# Altium schematic sheet Power.SchDoc: SPEC-A7
size 420 x 297 mm; Author: G.Kasprowicz; CompanyName: WUT ISE; DrawnBy: G.Kasprowicz; Organization: WUT ISE; Address1: PW ISE; Address2: Nowowiejska 15/19 00-665 Warsaw; Address3: gkasprow@gmail.com; Revision: 2; SheetNumber: 2; SheetTotal: 18; ModifiedBy: -; CheckedDate: -; Title2: Power supply; DivGrp: WUT ISE; Designer: G.Kasprowicz; ModifiedDate: -; ProjectName: Sensor Box
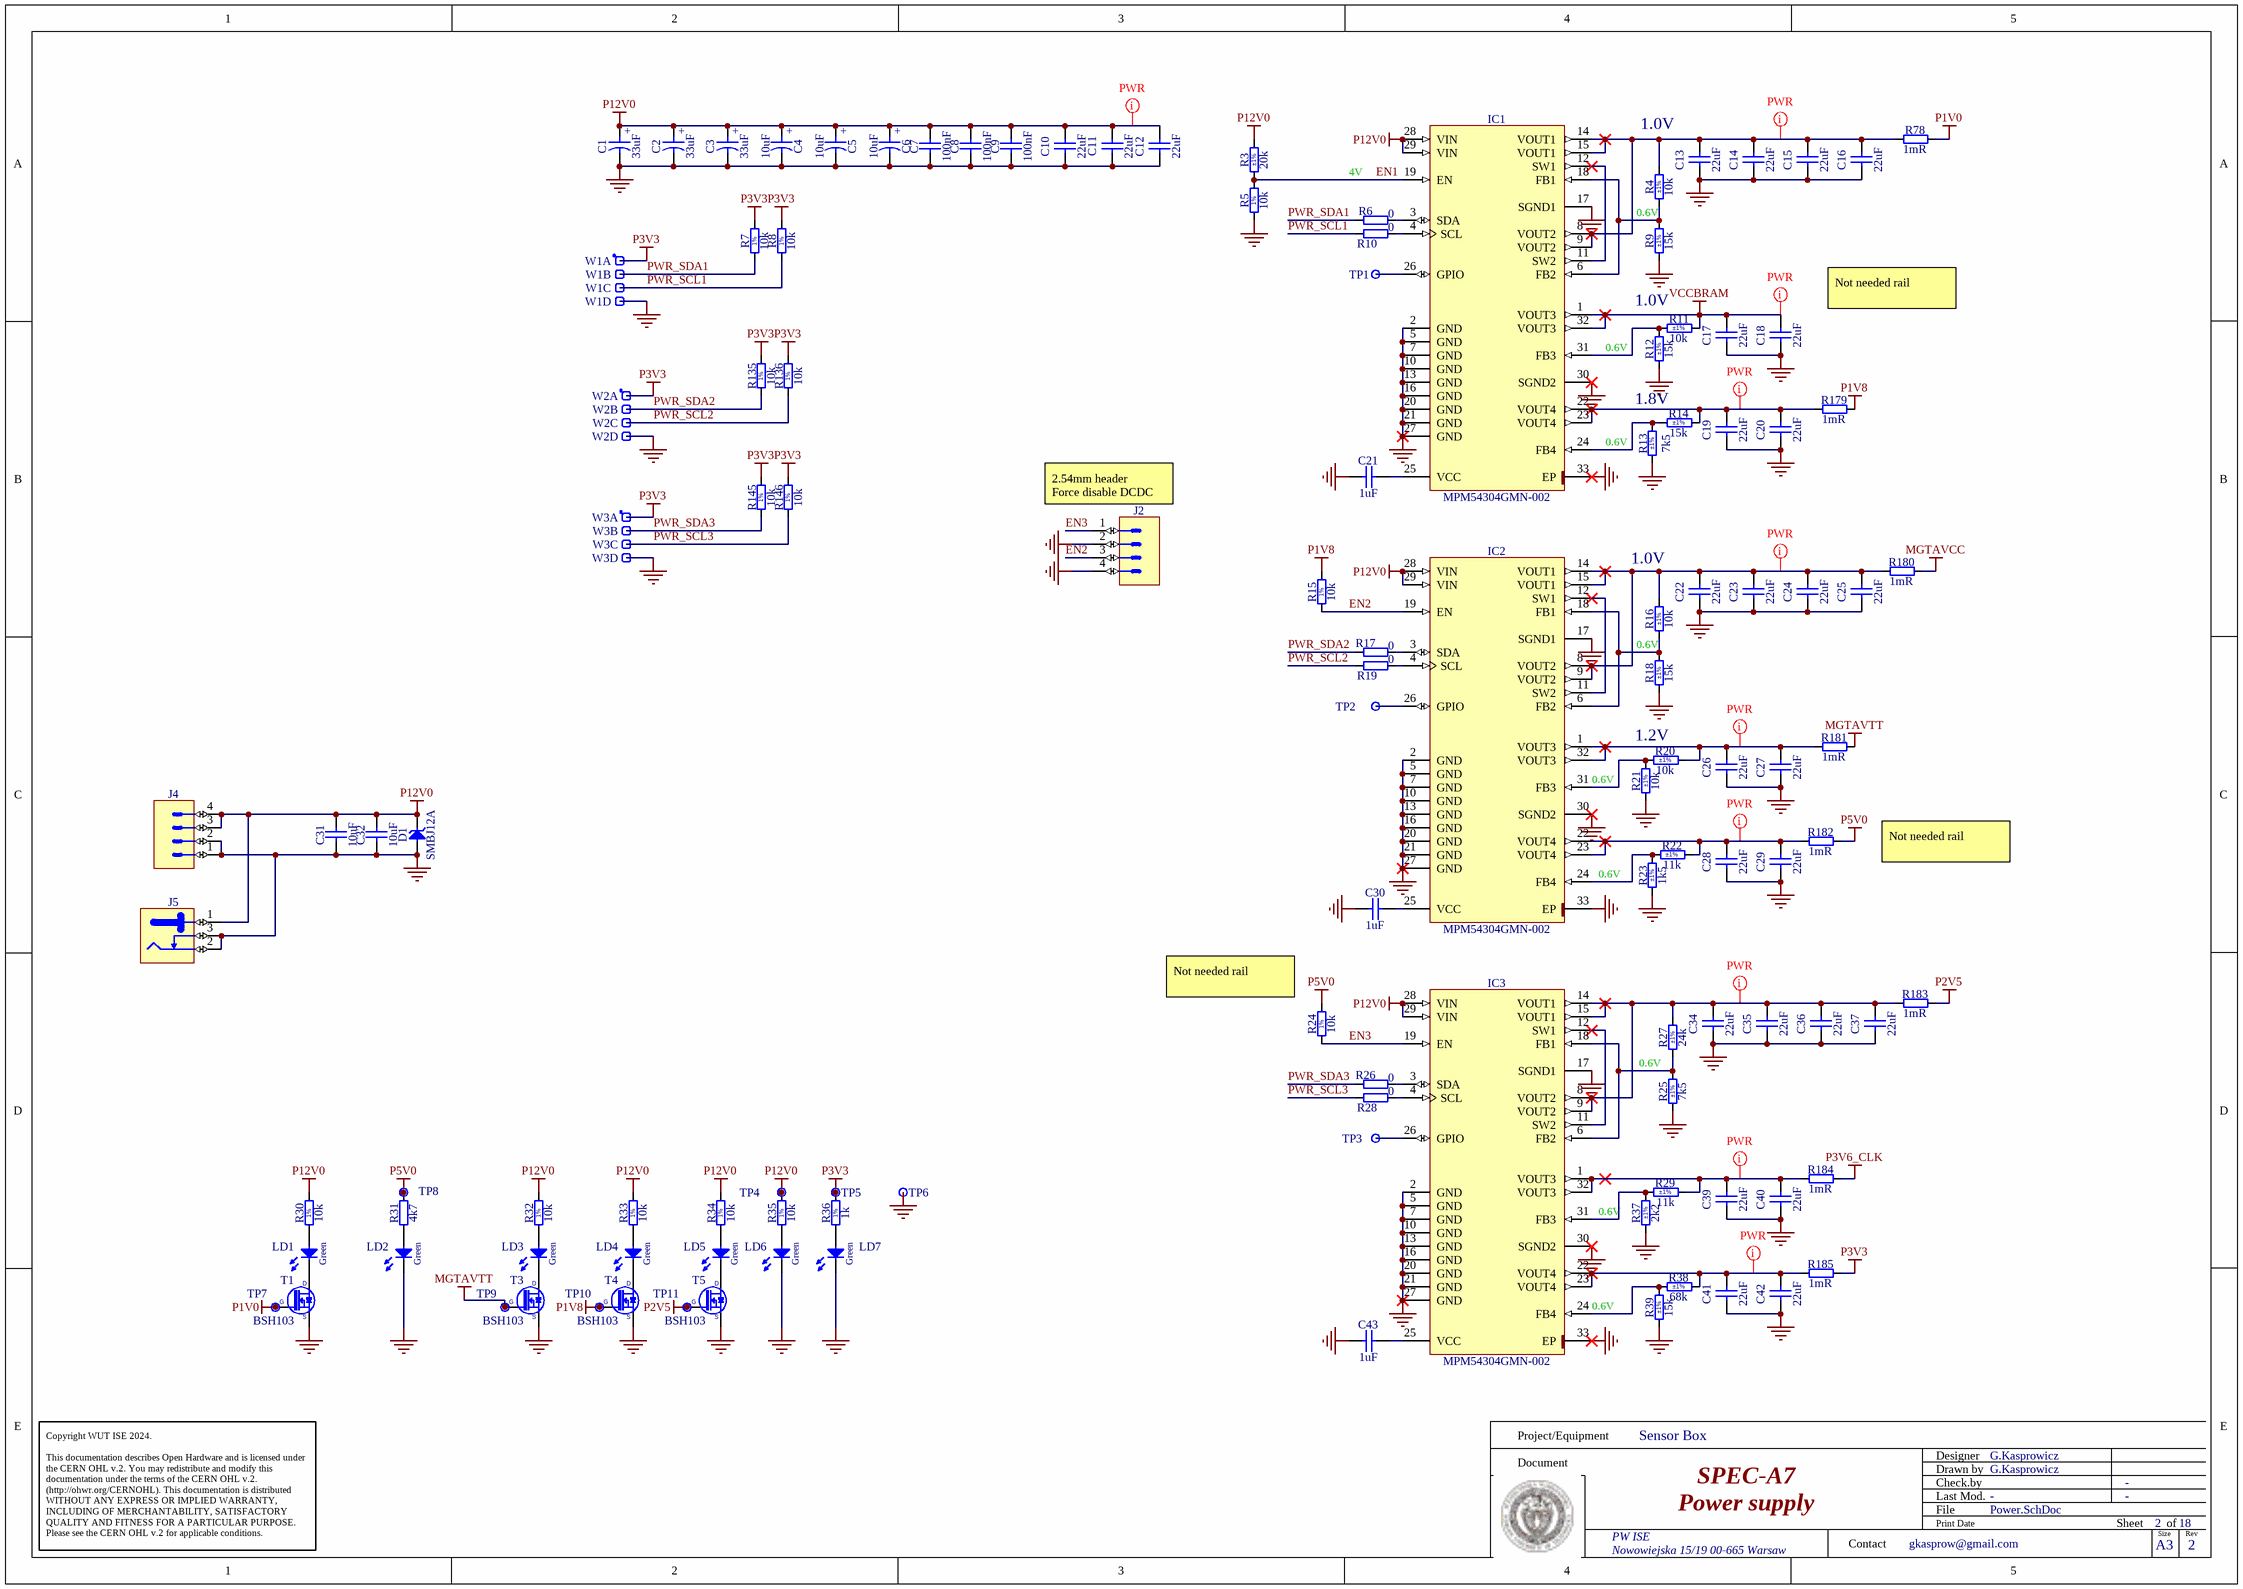
[diagram p0: Power.SchDoc]

## Parts
C1  33uF  [CAPMP3528X210N]
C2  33uF  [CAPMP3528X210N]
C3  33uF  [CAPMP3528X210N]
C4  10uF  [CAPMP3216X180N]
C5  10uF  [CAPMP3216X180N]
C6  10uF  [CAPMP3216X180N]
C7  100nF  [CAPC1005X55N]
C8  100nF  [CAPC1005X55N]
C9  100nF  [CAPC1005X55N]
C10  22uF  [CAPC2012X135N]
C11  22uF  [CAPC2012X135N]
C12  22uF  [CAPC2012X135N]
C13  22uF  [CAPC2012X135N]
C14  22uF  [CAPC2012X135N]
C15  22uF  [CAPC2012X135N]
C16  22uF  [CAPC2012X135N]
C17  22uF  [CAPC2012X135N]
C18  22uF  [CAPC2012X135N]
C19  22uF  [CAPC2012X135N]
C20  22uF  [CAPC2012X135N]
C21  1uF  [CAPC1005X55N]
C22  22uF  [CAPC2012X135N]
C23  22uF  [CAPC2012X135N]
C24  22uF  [CAPC2012X135N]
C25  22uF  [CAPC2012X135N]
C26  22uF  [CAPC2012X135N]
C27  22uF  [CAPC2012X135N]
C28  22uF  [CAPC2012X135N]
C29  22uF  [CAPC2012X135N]
C30  1uF  [CAPC1005X55N]
C31  10uF  [CAPC1608X80N]
C32  10uF  [CAPC1608X80N]
C34  22uF  [CAPC2012X135N]
C35  22uF  [CAPC2012X135N]
C36  22uF  [CAPC2012X135N]
C37  22uF  [CAPC2012X135N]
C39  22uF  [CAPC2012X135N]
C40  22uF  [CAPC2012X135N]
C41  22uF  [CAPC2012X135N]
C42  22uF  [CAPC2012X135N]
C43  1uF  [CAPC1005X55N]
D1  SMBJ12A  [DIOM5336X265N]
IC1  MPM54304GMN-002  [MPS_MPM54304GMN]
IC2  MPM54304GMN-002  [MPS_MPM54304GMN]
IC3  MPM54304GMN-002  [MPS_MPM54304GMN]
J2  Header 2  [SAMTEC_TSM-102-01-L-DV]  (value not drawn)
J4  Mini-Fit Jr.™  [MOLEX_39-30-0040]  (value not drawn)
J5  Jack  [CUI_PJ-102BH]  (value not drawn)
LD1  Green  [LED_KINGBRIGHT_KPH-1608CGCK]
LD2  Green  [LED_KINGBRIGHT_KPH-1608CGCK]
LD3  Green  [LED_KINGBRIGHT_KPH-1608CGCK]
LD4  Green  [LED_KINGBRIGHT_KPH-1608CGCK]
LD5  Green  [LED_KINGBRIGHT_KPH-1608CGCK]
LD6  Green  [LED_KINGBRIGHT_KPH-1608CGCK]
LD7  Green  [LED_KINGBRIGHT_KPH-1608CGCK]
R3  20k  Tolerance: ±1%  [RESC1005X40N]
R4  10k  Tolerance: ±1%  [RESC1005X40N]
R5  10k  [RESC1005X40N]
R6  0  [RESC1005X40N]
R7  10k  [RESC1005X40N]
R8  10k  [RESC1005X40N]
R9  15k  Tolerance: ±1%  [RESC1005X40N]
R10  0  [RESC1005X40N]
R11  10k  Tolerance: ±1%  [RESC1005X40N]
R12  15k  Tolerance: ±1%  [RESC1005X40N]
R13  7k5  Tolerance: ±1%  [RESC1005X40N]
R14  15k  Tolerance: ±1%  [RESC1005X40N]
R15  10k  [RESC1005X40N]
R16  10k  Tolerance: ±1%  [RESC1005X40N]
R17  0  [RESC1005X40N]
R18  15k  Tolerance: ±1%  [RESC1005X40N]
R19  0  [RESC1005X40N]
R20  10k  Tolerance: ±1%  [RESC1005X40N]
R21  10k  Tolerance: ±1%  [RESC1005X40N]
R22  11k  Tolerance: ±1%  [RESC1005X40N]
R23  1k5  Tolerance: ±1%  [RESC1005X40N]
R24  10k  [RESC1005X40N]
R25  7k5  Tolerance: ±1%  [RESC1005X40N]
R26  0  [RESC1005X40N]
R27  24k  Tolerance: ±1%  [RESC1005X40N]
R28  0  [RESC1005X40N]
R29  11k  Tolerance: ±1%  [RESC1005X40N]
R30  10k  [RESC1005X40N]
R31  4k7  [RESC1005X40N]
R32  10k  [RESC1005X40N]
R33  10k  [RESC1005X40N]
R34  10k  [RESC1005X40N]
R35  10k  [RESC1005X40N]
R36  1k  [RESC1005X40N]
R37  2k2  Tolerance: ±1%  [RESC1005X40N]
R38  68k  Tolerance: ±1%  [RESC1005X40N]
R39  15k  Tolerance: ±1%  [RESC1005X40N]
R78  1mR  [RESC2012X60N]
R135  10k  [RESC1005X40N]
R136  10k  [RESC1005X40N]
R145  10k  [RESC1005X40N]
R146  10k  [RESC1005X40N]
R179  1mR  [RESC2012X60N]
R180  1mR  [RESC2012X60N]
R181  1mR  [RESC2012X60N]
R182  1mR  [RESC2012X60N]
R183  1mR  [RESC2012X60N]
R184  1mR  [RESC2012X60N]
R185  1mR  [RESC2012X60N]
T1  BSH103  [SOT95P230X110-3N]
T3  BSH103  [SOT95P230X110-3N]
T4  BSH103  [SOT95P230X110-3N]
T5  BSH103  [SOT95P230X110-3N]
TP1  Test Point  [TPS127]  (value not drawn)  (no BOM)
TP2  Test Point  [TPS127]  (value not drawn)  (no BOM)
TP3  Test Point  [TPS127]  (value not drawn)  (no BOM)
TP4  Test Point  [TPS127]  (value not drawn)  (no BOM)
TP5  Test Point  [TPS127]  (value not drawn)  (no BOM)
TP6  Test Point  [TPS127]  (value not drawn)  (no BOM)
TP7  Test Point  [TPS127]  (value not drawn)  (no BOM)
TP8  Test Point  [TPS127]  (value not drawn)  (no BOM)
TP9  Test Point  [TPS127]  (value not drawn)  (no BOM)
TP10  Test Point  [TPS127]  (value not drawn)  (no BOM)
TP11  Test Point  [TPS127]  (value not drawn)  (no BOM)
W1  Header 4  [SAMTEC_HTSW-104-23-L-S]  (value not drawn)  (parts A,B,C,D of 4)
W2  Header 4  [SAMTEC_HTSW-104-23-L-S]  (value not drawn)  (parts A,B,C,D of 4)
W3  Header 4  [SAMTEC_HTSW-104-23-L-S]  (value not drawn)  (parts A,B,C,D of 4)

## Nets
GND: C1.2 C2.2 C3.2 C4.2 C5.2 C6.2 C7.1 C8.1 C9.1 C10.1 C11.1 C12.1 C13.1 C14.1 C15.1 C16.1 C17.1 C18.1 C19.1 C20.1 C21.1 C22.1 C23.1 C24.1 C25.1 C26.1 C27.1 C28.1 C29.1 C30.1 C31.1 C32.1 C34.1 C35.1 C36.1 C37.1 C39.1 C40.1 C41.1 C42.1 C43.1 D1.2(A) IC1.2(GND) IC1.5(GND) IC1.7(GND) IC1.10(GND) IC1.13(GND) IC1.16(GND) IC1.17(SGND1) IC1.20(GND) IC1.21(GND) IC1.27(GND) IC1.30(SGND2) IC1.33(EP) IC2.2(GND) IC2.5(GND) IC2.7(GND) IC2.10(GND) IC2.13(GND) IC2.16(GND) IC2.17(SGND1) IC2.20(GND) IC2.21(GND) IC2.27(GND) IC2.30(SGND2) IC2.33(EP) IC3.2(GND) IC3.5(GND) IC3.7(GND) IC3.10(GND) IC3.13(GND) IC3.16(GND) IC3.17(SGND1) IC3.20(GND) IC3.21(GND) IC3.27(GND) IC3.30(SGND2) IC3.33(EP) J2.2 J2.4 J4.1 J4.2 J5.2 J5.3 LD2.1(C) LD6.1(C) LD7.1(C) R5.1 R9.1 R12.1 R13.1 R18.1 R21.1 R23.1 R25.1 R37.1 R39.1 T1.2(S) T3.2(S) T4.2(S) T5.2(S) TP6.1 W1.4 W2.4 W3.4
MGTAVCC: R180.2
MGTAVTT: R181.2 T3.1(G) TP9.1
P1V0: R78.2 T1.1(G) TP7.1
P1V8: R15.2 R179.2 T4.1(G) TP10.1
P2V5: R183.2 T5.1(G) TP11.1
P3V3: R7.2 R8.2 R36.2 R135.2 R136.2 R145.2 R146.2 R185.2 TP5.1 W1.1 W2.1 W3.1
P3V6_CLK: R184.2
P5V0: R24.2 R31.2 R182.2 TP8.1
P12V0: C1.1 C2.1 C3.1 C4.1 C5.1 C6.1 C7.2 C8.2 C9.2 C10.2 C11.2 C12.2 C31.2 C32.2 D1.1(C) IC1.28(VIN) IC1.29(VIN) IC2.28(VIN) IC2.29(VIN) IC3.28(VIN) IC3.29(VIN) J4.3 J4.4 J5.1 R3.2 R30.2 R32.2 R33.2 R34.2 R35.2 TP4.1
VCCBRAM: C17.2 C18.2 IC1.1(VOUT3) IC1.32(VOUT3) R11.2
EN1: IC1.19(EN) R3.1 R5.2
EN2: IC2.19(EN) J2.3 R15.1
EN3: IC3.19(EN) J2.1 R24.1
PWR_SCL1: R8.1 R10.1 W1.3
PWR_SCL2: R19.1 R136.1 W2.3
PWR_SCL3: R28.1 R146.1 W3.3
PWR_SDA1: R6.1 R7.1 W1.2
PWR_SDA2: R17.1 R135.1 W2.2
PWR_SDA3: R26.1 R145.1 W3.2
NetC13_2: C13.2 C14.2 C15.2 C16.2 IC1.8(VOUT2) IC1.9(VOUT2) IC1.14(VOUT1) IC1.15(VOUT1) R4.2 R78.1
NetC19_2: C19.2 C20.2 IC1.22(VOUT4) IC1.23(VOUT4) R14.2 R179.1
NetC21_2: C21.2 IC1.25(VCC)
NetC22_2: C22.2 C23.2 C24.2 C25.2 IC2.8(VOUT2) IC2.9(VOUT2) IC2.14(VOUT1) IC2.15(VOUT1) R16.2 R180.1
NetC26_2: C26.2 C27.2 IC2.1(VOUT3) IC2.32(VOUT3) R20.2 R181.1
NetC28_2: C28.2 C29.2 IC2.22(VOUT4) IC2.23(VOUT4) R22.2 R182.1
NetC30_2: C30.2 IC2.25(VCC)
NetC34_2: C34.2 C35.2 C36.2 C37.2 IC3.8(VOUT2) IC3.9(VOUT2) IC3.14(VOUT1) IC3.15(VOUT1) R27.2 R183.1
NetC39_2: C39.2 C40.2 IC3.1(VOUT3) IC3.32(VOUT3) R29.2 R184.1
NetC41_2: C41.2 C42.2 IC3.22(VOUT4) IC3.23(VOUT4) R38.2 R185.1
NetC43_2: C43.2 IC3.25(VCC)
NetIC1_3: IC1.3(SDA) R6.2
NetIC1_4: IC1.4(SCL) R10.2
NetIC1_6: IC1.6(FB2) IC1.18(FB1) R4.1 R9.2
NetIC1_11: IC1.11(SW2) IC1.12(SW1)
NetIC1_24: IC1.24(FB4) R13.2 R14.1
NetIC1_26: IC1.26(GPIO) TP1.1
NetIC1_31: IC1.31(FB3) R11.1 R12.2
NetIC2_3: IC2.3(SDA) R17.2
NetIC2_4: IC2.4(SCL) R19.2
NetIC2_6: IC2.6(FB2) IC2.18(FB1) R16.1 R18.2
NetIC2_11: IC2.11(SW2) IC2.12(SW1)
NetIC2_24: IC2.24(FB4) R22.1 R23.2
NetIC2_26: IC2.26(GPIO) TP2.1
NetIC2_31: IC2.31(FB3) R20.1 R21.2
NetIC3_3: IC3.3(SDA) R26.2
NetIC3_4: IC3.4(SCL) R28.2
NetIC3_6: IC3.6(FB2) IC3.18(FB1) R25.2 R27.1
NetIC3_11: IC3.11(SW2) IC3.12(SW1)
NetIC3_24: IC3.24(FB4) R38.1 R39.2
NetIC3_26: IC3.26(GPIO) TP3.1
NetIC3_31: IC3.31(FB3) R29.1 R37.2
NetLD1_1: LD1.1(C) T1.3(D)
NetLD1_2: LD1.2(A) R30.1
NetLD2_2: LD2.2(A) R31.1
NetLD3_1: LD3.1(C) T3.3(D)
NetLD3_2: LD3.2(A) R32.1
NetLD4_1: LD4.1(C) T4.3(D)
NetLD4_2: LD4.2(A) R33.1
NetLD5_1: LD5.1(C) T5.3(D)
NetLD5_2: LD5.2(A) R34.1
NetLD6_2: LD6.2(A) R35.1
NetLD7_2: LD7.2(A) R36.1

## Layout directives
net class PWR: NetC13_2, NetC19_2, NetC22_2, NetC26_2, NetC28_2, NetC34_2, NetC39_2, NetC41_2, P12V0, VCCBRAM

## Notes on the sheet
- 4V
- 1.0V
- 0.6V
- (near C18) Not needed rail
- 1.8V
- (near J2) 2.54mm header
  Force disable DCDC
- 1.2V
- (near R182) Not needed rail
- (near R24) Not needed rail
- (near IC3) 0.6V
- Project/Equipment
- Document
- Designer
- Drawn by
- Check.by
- Copyright WUT ISE 2024.
  This documentation describes Open Hardware and is licensed under the CERN OHL v.2. You may redistribute and modify this documentation under the terms of the CERN OHL v.2. (http://ohwr.org/CERNOHL). This documentation is distributed WITHOUT ANY EXPRESS OR IMPLIED WARRANTY, INCLUDING OF MERCHANTABILITY, SATISFACTORY QUALITY AND FITNESS FOR A PARTICULAR PURPOSE. Please see the CERN OHL v.2 for applicable conditions.
- Contact
- File
- Last Mod.
- Print Date
- Sheet
- Size
- A3
- of
- Rev
- (in symbol CTE3216-18_10UF_16V_20%_AVX_TCJ) +
- (in symbol CTE3528-21_33UF_16V_10%) +
- (in symbol R0402_1k_1%_0.0625W_100PPM) 1%
- (in symbol R0402_10k_1%_0.0625W_100PPM) 1%
- (in symbol R0402_10K_1%_0.0625W_100PPM) 1%

## Library data of the parts
C1-C3 = CTE3528-21_33UF_16V_10%: Polarised capacitor; Part Description: Solid Tantalum Chip Capacitor; Manufacturer: GENERIC; Manufacturer1 Part Number: TAJB336K016R; Voltage: 16V; Tolerance: ±10%; Part Number: CTE3528-21_33UF_16V_10%; Component Kind: Standard; Component Type: Standard; Pin Count: 2; Value: 33uF; Status: Preferred; Manufacturer Part Number: CTE3528-21_33UF_16V_10%; Case: B; Mounted: Yes; Socket: No; SMD: Yes; Sense: No; HelpURL: \\cern.ch\dfs\Applications\Altium\Datasheets\CTE_AVX_TAJ.pdf; Author: CERN DEM JLC; CreateDate: 03.12.2007; LatestRevisionDate: 03.12.2007; Manufacturer1 Example: AVX; Manufacturer1 ComponentHeight: 2.1mm
C4-C6 = CTE3216-18_10UF_16V_20%_AVX_TCJ: Polarised capacitor; Part Description: ESR 0R200 Tantalum Solid Electrolytic Chip Capacitor with Conductive Polymer Electrode; Manufacturer: AVX; Manufacturer Part Number: TCJA106M016R0200; Voltage: 16V; Tolerance: ±20%; Part Number: CTE3216-18_10UF_16V_20%_AVX_TCJ; Component Kind: Standard; Component Type: Standard; Pin Count: 2; Value: 10uF; Status: Preferred; Case: A; Mounted: Yes; Socket: No; SMD: Yes; Sense: No; ComponentHeight: 1.8mm; HelpURL: \\cern.ch\dfs\Applications\Altium\Datasheets\CTE_AVX_TCJ.pdf; Author: CERN DEM JLC; CreateDate: 29.03.2012; LatestRevisionDate: 29.03.2012
C7-C9 = CC0402_100NF_16V_10%_X7R: Non-polarised capacitor; Part Description: SMD Multilayer Chip Ceramic Capacitor; Manufacturer: GENERIC; Manufacturer1 Part Number: GRM155R71C104KA88D; Voltage: 16V; TC: X7R; Tolerance: ±10%; Part Number: CC0402_100NF_16V_10%_X7R; Component Kind: Standard; Component Type: Standard; Pin Count: 2; Value: 100nF; Status: Not Recommended; Manufacturer Part Number: CC0402_100NF_16V_10%_X7R; Case: 0402; Mounted: Yes; Socket: No; SMD: Yes; Sense: No; Manufacturer1 Example: MURATA; Manufacturer1 ComponentHeight: 0.55mm; HelpURL: \\cern.ch\dfs\Applications\Altium\Datasheets\CC0402_X7R_MURATA_GRM.pdf; Author: CERN DEM JLC; CreateDate: 05/12/2013; LatestRevisionDate: 03/12/2007
C10-C20 C22-C29 C34-C37 C39-C42 = CC0805_22UF_16V_10%_X5R: Non-polarised capacitor; Manufacturer: GENERIC; Part Description: SMD Multilayer Chip Ceramic Capacitor; Manufacturer1 Part Number: C2012X5R1C226KT; Tolerance: ±10%; Voltage: 16V; TC: X5R; Manufacturer Part Number: CC0805_22UF_16V_10%_X5R; Part Number: CC0805_22UF_16V_10%_X5R; Value: 22uF; Component Kind: Standard; Component Type: Standard; Pin Count: 2; Status: Preferred; Case: 0805; Mounted: Yes; Socket: No; SMD: Yes; Sense: No; Manufacturer1 Example: TDK; Manufacturer1 ComponentHeight: 1.35mm; HelpURL: \\cern.ch\dfs\Applications\Altium\Datasheets\CC0805_X5R_TDK_C.pdf; Author: CERN DEM JLC; CreateDate: 25.10.2012; LatestRevisionDate: 25.10.2012
C21 C30 C43 = CC0402_1UF_16V_10%_X5R: Non-polarised capacitor; Part Description: SMD Multilayer Chip Ceramic Capacitor; Manufacturer: GENERIC; Manufacturer1 Part Number: C1005X5R1C105KT; Voltage: 16V; TC: X5R; Tolerance: ±10%; Part Number: CC0402_1UF_16V_10%_X5R; Component Kind: Standard; Component Type: Standard; Pin Count: 2; Value: 1uF; Status: Preferred; Manufacturer Part Number: CC0402_1UF_16V_10%_X5R; Case: 0402; Mounted: Yes; Socket: No; SMD: Yes; Sense: No; Manufacturer1 Example: TDK; Manufacturer1 ComponentHeight: 0.55mm; HelpURL: \\cern.ch\dfs\Applications\Altium\Datasheets\CC0402_X5R_TDK_C.pdf; Author: CERN DEM JLC; CreateDate: 25.10.2012; LatestRevisionDate: 25.10.2012
C31 C32 = CC0603_10UF_16V_20%_X5R: Non-polarised capacitor; Part Description: SMD Multilayer Chip Ceramic Capacitor; Manufacturer: GENERIC; Manufacturer1 Part Number: GRM188R61C106MA73D; Voltage: 16V; TC: X5R; Tolerance: ±20%; Part Number: CC0603_10UF_16V_20%_X5R; Component Kind: Standard; Component Type: Standard; Pin Count: 2; Value: 10uF; Status: None; Manufacturer Part Number: CC0603_10UF_16V_20%_X5R; Case: 0603; Mounted: Yes; Socket: No; SMD: Yes; Sense: No; Manufacturer1 Example: MURATA; Manufacturer1 ComponentHeight: 0.8mm; HelpURL: \\cern.ch\dfs\Applications\Altium\Datasheets\CC0603_X5R_MURATA_GRM.pdf; Author: CERN DEM MR; CreateDate: 02.03.2016; LatestRevisionDate: 02.03.2016
D1 = SMBJ12A: Zener Diode; Part Description: Uni-Directional Transient Voltage Suppressor Diode; Manufacturer: FAIRCHILD SEMICONDUCTOR; Voltage: 12V; Power: 600W; PressFit: No; Bonding: No; Part Number: SMBJ12A; Component Kind: Standard; Component Type: Standard; Device: SMBJ12A; PackageDescription: DO-214-AA/SMB Diode, Molded Body; 5.34mm L X 3.625mm W X 2.65mm H, IPC Medium Density; Manufacturer Part Number: SMBJ12A; Pin Count: 2; Case: DO-214AA; Mounted: Yes; Socket: No; SMD: Yes; Sense: No; ComponentHeight: 2.65mm; HelpURL: \\cern.ch\dfs\Applications\Altium\Datasheets\SMBJ.pdf; Author: CERN DEM JLC; CreateDate: 10.04.2013; LatestRevisionDate: 10.04.2013
IC1-IC3 = MPM54304GMN-XXXX: Quad-Output Power Module with I2C and MTP; Part Description: 4V to 16V Input, Quad-Output Power Module with I2C and MTP; Manufacturer: MPS (MONOLITIC  POWER SYSTEMS); PressFit: No; Bonding: No; Part Number: MPM54304GMN-002; Component Kind: Standard; Component Type: Standard; Device: MPM54304GMN-002; PackageDescription: MPS LGA-33 Case, 0.65mm Pitch, Rect.; 32 Pin, 7.00mm L X 7.00mm W X 2.10mm H body (w/Thermal Tab 3.55 X 3.55mm); Manufacturer Part Number: MPM54304GMN-002; Pin Count: 33; Case: QFN32; Mounted: Yes; Socket: No; SMD: Yes; Sense: No; ComponentHeight: 2.1mm; HelpURL: \\cern.ch\dfs\Applications\Altium\Datasheets\MPM54304GMN.pdf; Author: CERN DEM BC; CreateDate: 09.11.2020; LatestRevisionDate: 23.11.2022
J2 = SAMTEC_TSM-102-01-L-DV: Connector 4 Male; Part Description: 2 Contacts, Pitch 2.54mm, Dual Row Surface Mount Straight Header (Post Lead 5.84mm); Manufacturer: SAMTEC; PressFit: No; Part Number: SAMTEC_TSM-102-01-L-DV; Component Kind: Standard; Component Type: Standard; Pin Count: 4; Family: Header 2; Mounted: Yes; Socket: No; SMD: Yes; Sense: No; Status: None; Manufacturer Part Number: TSM-102-01-L-DV; ComponentHeight: 9.65mm; HelpURL: \\cern.ch\dfs\Applications\Altium\Datasheets\SAMTEC_TSM-102-01-L-DV.pdf; Author: CERN DEM MR; CreateDate: 28.11.2017; LatestRevisionDate: 28.11.2017
J4 = MOLEX_39-30-0040: Connector 4 Male; Part Description: 4.20mm (.165") Pitch Mini-Fit Jr. Header, Dual Row, Right Angle with Snap-in Plastic Peg PCB Lock, 4 Circuits; Manufacturer: MOLEX; PressFit: No; Part Number: MOLEX_39-30-0040; Component Kind: Standard; Component Type: Standard; Pin Count: 4; Family: Mini-Fit Jr.™; Mounted: Yes; Socket: No; SMD: No; Sense: No; Status: None; Manufacturer Part Number: 39-30-0040; ComponentHeight: 11.4mm; HelpURL: \\cern.ch\dfs\Applications\Altium\Datasheets\MOLEX_39-30-0040.pdf; Author: CERN DEM JLC; CreateDate: 2018-10-02; LatestRevisionDate: 2018-10-02
J5 = CUI_PJ-102BH: 2.5 mm Center Pin, 5A, 24V Right Angle, Through Hole, Tapered Pins, DC Power Jack Connector; Part Description: 2.5 mm Center Pin, 5A, 24V, Right Angle, Through Hole, Tapered Pins, DC Power Jack Connector; Manufacturer: CUI INC.; PressFit: No; Part Number: CUI_PJ-102BH; Component Kind: Standard; Component Type: Standard; Pin Count: 3; Family: Jack; Mounted: Yes; Socket: No; SMD: No; Sense: No; Status: None; Manufacturer Part Number: PJ-102BH; ComponentHeight: 11mm; HelpURL: \\cern.ch\dfs\Applications\Altium\Datasheets\CUI_PJ-102BH.pdf; Author: CERN DEM JLC; CreateDate: 14.08.2013; LatestRevisionDate: 14.08.2013
LD1-LD7 = LED_KINGBRIGHT_KPH-1608CGCK: LED Green 1C 2A; Part Description: SMD Green LED, Case 1.6mmX0.8mm(0603), 0.65mm Thickness; PressFit: No; Bonding: No; Manufacturer Part Number: KPH-1608CGCK; ComponentHeight: 0.65mm; HelpURL: \\cern.ch\dfs\Applications\Altium\Datasheets\LED_KINGBRIGHT_KPH-1608CGCK.pdf; Part Number: LED_KINGBRIGHT_KPH-1608CGCK; Component Kind: Standard; Component Type: Standard; Color: Green; PackageDescription: SMT Green LED, Case 0603, Body L 1.6 x W 0.8mm H 0.65mm; Manufacturer: KINGBRIGHT; Pin Count: 2; Mounted: Yes; Socket: No; SMD: Yes; Sense: No; Author: CERN DEM JLC; CreateDate: 03.07.2017; LatestRevisionDate: 03.07.2017
R3 = R0402_20K_1%_0.0625W_100PPM: Resistor - 1%; Part Description: General Purpose Thick Film Chip Resistor; Manufacturer: GENERIC; Manufacturer1 Part Number: 232270672003L; TC: ±100ppm/°C; PressFit: No; Part Number: R0402_20K_1%_0.0625W_100PPM; Component Kind: Standard; Component Type: Standard; Pin Count: 2; Value: 20k; Status: Not Recommended; Power: 0.0625W; Manufacturer Part Number: R0402_20K_1%_0.0625W_100PPM; Case: 0402; Mounted: Yes; Sense: No; Socket: No; SMD: Yes; Manufacturer1 Example: YAGEO PHYCOMP; Manufacturer1 ComponentHeight: 0.4mm; HelpURL: \\cern.ch\dfs\Applications\Altium\Datasheets\R0402_Phycomp_RC0402.pdf; Author: CERN DEM JLC; CreateDate: 03.12.2007; LatestRevisionDate: 17.10.2012
R4 R5 R7 R8 R11 R15 R16 R20 R21 R24 R135 R136 R145 R146 = R0402_10K_1%_0.0625W_100PPM: Resistor - 1%; Part Description: General Purpose Thick Film Chip Resistor; Manufacturer: GENERIC; Manufacturer1 Part Number: 232270671003L; TC: ±100ppm/°C; PressFit: No; Part Number: R0402_10K_1%_0.0625W_100PPM; Component Kind: Standard; Component Type: Standard; Pin Count: 2; Value: 10k; Status: Not Recommended; Power: 0.0625W; Manufacturer Part Number: R0402_10K_1%_0.0625W_100PPM; Case: 0402; Mounted: Yes; Sense: No; Socket: No; SMD: Yes; Manufacturer1 Example: YAGEO PHYCOMP; Manufacturer1 ComponentHeight: 0.4mm; HelpURL: \\cern.ch\dfs\Applications\Altium\Datasheets\R0402_Phycomp_RC0402.pdf; Author: CERN DEM JLC; CreateDate: 03.12.2007; LatestRevisionDate: 17.10.2012
  R5 R7 R8 R15 R24 R135 R136 R145 R146: Tolerance: ±1%
R6 R10 R17 R19 R26 R28 = R0402_0R_JUMPER: Resistor; Part Description: 1A (0.05R Max DC Resistance) Zero Ohm Jumper; Manufacturer: GENERIC; Manufacturer1 Part Number: 232270591001L; PressFit: No; Part Number: R0402_0R_JUMPER; Component Kind: Standard; Component Type: Standard; Pin Count: 2; Value: 0; Status: Not Recommended; Manufacturer Part Number: R0402_0R_JUMPER; Case: 0402; Mounted: Yes; Sense: No; Socket: No; SMD: Yes; Manufacturer1 Example: YAGEO PHYCOMP; Manufacturer1 ComponentHeight: 0.4mm; HelpURL: \\cern.ch\dfs\Applications\Altium\Datasheets\R0402_Phycomp_RC0402.pdf; Author: CERN DEM JLC; CreateDate: 03.12.2007; LatestRevisionDate: 17.10.2012
R9 R12 R14 R18 R39 = R0402_15K_1%_0.0625W_100PPM: Resistor - 1%; Part Description: General Purpose Thick Film Chip Resistor; Manufacturer: GENERIC; Manufacturer1 Part Number: CRCW040215K0FK; TC: ±100ppm/°C; PressFit: No; Part Number: R0402_15K_1%_0.0625W_100PPM; Component Kind: Standard; Component Type: Standard; Pin Count: 2; Value: 15k; Status: Preferred; Power: 0.0625W; Manufacturer Part Number: R0402_15K_1%_0.0625W_100PPM; Case: 0402; Mounted: Yes; Sense: No; Socket: No; SMD: Yes; Manufacturer1 Example: VISHAY; Manufacturer1 ComponentHeight: 0.4mm; HelpURL: \\cern.ch\dfs\Applications\Altium\Datasheets\R0402_VISHAY_CRCW e3.pdf; Author: CERN DEM JMW; CreateDate: 06.07.2015; LatestRevisionDate: 06.07.2015
R13 R25 = R0402_7K5_1%_0.0625W_100PPM: Resistor - 1%; Part Description: General Purpose Thick Film Chip Resistor; Manufacturer: GENERIC; Manufacturer1 Part Number: 232270677502L; TC: ±100ppm/°C; PressFit: No; Part Number: R0402_7K5_1%_0.0625W_100PPM; Component Kind: Standard; Component Type: Standard; Pin Count: 2; Value: 7k5; Status: Not Recommended; Power: 0.0625W; Manufacturer Part Number: R0402_7K5_1%_0.0625W_100PPM; Case: 0402; Mounted: Yes; Sense: No; Socket: No; SMD: Yes; Manufacturer1 Example: YAGEO PHYCOMP; Manufacturer1 ComponentHeight: 0.4mm; HelpURL: \\cern.ch\dfs\Applications\Altium\Datasheets\R0402_Phycomp_RC0402.pdf; Author: CERN DEM JLC; CreateDate: 03.12.2007; LatestRevisionDate: 17.10.2012
R22 R29 = R0402_11K_1%_0.0625W_100PPM: Resistor - 1%; Part Description: General Purpose Thick Film Chip Resistor; Manufacturer: GENERIC; Manufacturer1 Part Number: 232270671103L; TC: ±100ppm/°C; PressFit: No; Part Number: R0402_11K_1%_0.0625W_100PPM; Component Kind: Standard; Component Type: Standard; Pin Count: 2; Value: 11k; Status: Not Recommended; Power: 0.0625W; Manufacturer Part Number: R0402_11K_1%_0.0625W_100PPM; Case: 0402; Mounted: Yes; Sense: No; Socket: No; SMD: Yes; Manufacturer1 Example: YAGEO PHYCOMP; Manufacturer1 ComponentHeight: 0.4mm; HelpURL: \\cern.ch\dfs\Applications\Altium\Datasheets\R0402_Phycomp_RC0402.pdf; Author: CERN DEM JLC; CreateDate: 03.12.2007; LatestRevisionDate: 17.10.2012
R23 = R0402_1K5_1%_0.0625W_100PPM: Resistor - 1%; Part Description: General Purpose Thick Film Chip Resistor; Manufacturer: GENERIC; Manufacturer1 Part Number: 232270671502L; TC: ±100ppm/°C; PressFit: No; Part Number: R0402_1K5_1%_0.0625W_100PPM; Component Kind: Standard; Component Type: Standard; Pin Count: 2; Value: 1k5; Status: Not Recommended; Power: 0.0625W; Manufacturer Part Number: R0402_1K5_1%_0.0625W_100PPM; Case: 0402; Mounted: Yes; Sense: No; Socket: No; SMD: Yes; Manufacturer1 Example: YAGEO PHYCOMP; Manufacturer1 ComponentHeight: 0.4mm; HelpURL: \\cern.ch\dfs\Applications\Altium\Datasheets\R0402_Phycomp_RC0402.pdf; Author: CERN DEM JLC; CreateDate: 03.12.2007; LatestRevisionDate: 17.10.2012
R27 = R0402_24K_1%_0.0625W_100PPM: Resistor - 1%; Part Description: General Purpose Thick Film Chip Resistor; Manufacturer: GENERIC; Manufacturer1 Part Number: 232270672403L; TC: ±100ppm/°C; PressFit: No; Part Number: R0402_24K_1%_0.0625W_100PPM; Component Kind: Standard; Component Type: Standard; Pin Count: 2; Value: 24k; Status: Not Recommended; Power: 0.0625W; Manufacturer Part Number: R0402_24K_1%_0.0625W_100PPM; Case: 0402; Mounted: Yes; Sense: No; Socket: No; SMD: Yes; Manufacturer1 Example: YAGEO PHYCOMP; Manufacturer1 ComponentHeight: 0.4mm; HelpURL: \\cern.ch\dfs\Applications\Altium\Datasheets\R0402_Phycomp_RC0402.pdf; Author: CERN DEM JLC; CreateDate: 03.12.2007; LatestRevisionDate: 17.10.2012
R30 R32-R35 = R0402_10k_1%_0.0625W_100PPM: Resistor - 1%; Part Description: General Purpose Thick Film Chip Resistor; Manufacturer: GENERIC; Manufacturer1 Part Number: 232270671003L; TC: ±100ppm/°C; PressFit: No; Part Number: R0402_10K_1%_0.0625W_100PPM; Component Kind: Standard; Component Type: Standard; Pin Count: 2; Value: 10k; Status: Not Recommended; Power: 0.0625W; Tolerance: ±1%; Manufacturer Part Number: R0402_10K_1%_0.0625W_100PPM; Case: 0402; Mounted: Yes; Sense: No; Socket: No; SMD: Yes; Manufacturer1 Example: YAGEO PHYCOMP; Manufacturer1 ComponentHeight: 0.4mm; HelpURL: \\cern.ch\dfs\Applications\Altium\Datasheets\R0402_Phycomp_RC0402.pdf; Author: CERN DEM JLC; CreateDate: 03.12.2007; LatestRevisionDate: 17.10.2012
R31 = R0402_4K7_1%_0.0625W_100PPM: Resistor - 1%; Part Description: General Purpose Thick Film Chip Resistor; Manufacturer: GENERIC; Manufacturer1 Part Number: 232270674702L; TC: ±100ppm/°C; PressFit: No; Part Number: R0402_4K7_1%_0.0625W_100PPM; Component Kind: Standard; Component Type: Standard; Pin Count: 2; Value: 4k7; Status: Not Recommended; Power: 0.0625W; Tolerance: ±1%; Manufacturer Part Number: R0402_4K7_1%_0.0625W_100PPM; Case: 0402; Mounted: Yes; Sense: No; Socket: No; SMD: Yes; Manufacturer1 Example: YAGEO PHYCOMP; Manufacturer1 ComponentHeight: 0.4mm; HelpURL: \\cern.ch\dfs\Applications\Altium\Datasheets\R0402_Phycomp_RC0402.pdf; Author: CERN DEM JLC; CreateDate: 03.12.2007; LatestRevisionDate: 17.10.2012
R36 = R0402_1k_1%_0.0625W_100PPM: Resistor - 1%; Part Description: General Purpose Thick Film Chip Resistor; Manufacturer: GENERIC; Manufacturer1 Part Number: 232270671002L; TC: ±100ppm/°C; PressFit: No; Part Number: R0402_1K_1%_0.0625W_100PPM; Component Kind: Standard; Component Type: Standard; Pin Count: 2; Value: 1k; Status: Not Recommended; Power: 0.0625W; Tolerance: ±1%; Manufacturer Part Number: R0402_1K_1%_0.0625W_100PPM; Case: 0402; Mounted: Yes; Sense: No; Socket: No; SMD: Yes; Manufacturer1 Example: YAGEO PHYCOMP; Manufacturer1 ComponentHeight: 0.4mm; HelpURL: \\cern.ch\dfs\Applications\Altium\Datasheets\R0402_Phycomp_RC0402.pdf; Author: CERN DEM JLC; CreateDate: 03.12.2007; LatestRevisionDate: 17.10.2012
R37 = R0402_2K2_1%_0.0625W_100PPM: Resistor - 1%; Part Description: General Purpose Thick Film Chip Resistor; Manufacturer: GENERIC; Manufacturer1 Part Number: 232270672202L; TC: ±100ppm/°C; PressFit: No; Part Number: R0402_2K2_1%_0.0625W_100PPM; Component Kind: Standard; Component Type: Standard; Pin Count: 2; Value: 2k2; Status: Not Recommended; Power: 0.0625W; Manufacturer Part Number: R0402_2K2_1%_0.0625W_100PPM; Case: 0402; Mounted: Yes; Sense: No; Socket: No; SMD: Yes; Manufacturer1 Example: YAGEO PHYCOMP; Manufacturer1 ComponentHeight: 0.4mm; HelpURL: \\cern.ch\dfs\Applications\Altium\Datasheets\R0402_Phycomp_RC0402.pdf; Author: CERN DEM JLC; CreateDate: 03.12.2007; LatestRevisionDate: 17.10.2012
R38 = R0402_68K_1%_0.0625W_100PPM: Resistor - 1%; Part Description: General Purpose Thick Film Chip Resistor; Manufacturer: GENERIC; Manufacturer1 Part Number: 232270676803L; TC: ±100ppm/°C; PressFit: No; Part Number: R0402_68K_1%_0.0625W_100PPM; Component Kind: Standard; Component Type: Standard; Pin Count: 2; Value: 68k; Status: Not Recommended; Power: 0.0625W; Manufacturer Part Number: R0402_68K_1%_0.0625W_100PPM; Case: 0402; Mounted: Yes; Sense: No; Socket: No; SMD: Yes; Manufacturer1 Example: YAGEO PHYCOMP; Manufacturer1 ComponentHeight: 0.4mm; HelpURL: \\cern.ch\dfs\Applications\Altium\Datasheets\R0402_Phycomp_RC0402.pdf; Author: CERN DEM JLC; CreateDate: 03.12.2007; LatestRevisionDate: 17.10.2012
R78 R179-R185 = R0805_0R_JUMPER: MSMA0805R0010FSM; Part Description: 2A (0.05R Max DC Resistance) Zero Ohm Jumper; Manufacturer: GENERIC; Manufacturer1 Part Number: NRC10Z0; PressFit: No; Part Number: MSMA0805R0010FSM; Component Kind: Standard; Component Type: Standard; Pin Count: 2; Value: 1mR; Status: Preferred; Manufacturer Part Number: R0805_0R_JUMPER; Case: 0805; Mounted: Yes; Sense: No; Socket: No; SMD: Yes; Manufacturer1 Example: NIC COMPONENT; Manufacturer1 ComponentHeight: 0.6mm; HelpURL: \\cern.ch\dfs\Applications\Altium\Datasheets\R0805_NIC_NRC.pdf; Author: CERN DEM JLC; CreateDate: 03.12.2007; LatestRevisionDate: 13.03.2008
T1 T3-T5 = BSH103: N-CHANNEL MOSFET WITH DIODE; Part Description: 30V 850mA N-Channel Enhancement Mode Field-Effect Transistor; Manufacturer: NEXPERIA; PressFit: No; Bonding: No; Part Number: BSH103; Component Kind: Standard; Component Type: Standard; Device: BSH103; PackageDescription: SOT23, 3 pin, Pitch 0.95mm - 1.3mm W X 2.9mm L X 1.1mm H, IPC Medium Density; Manufacturer Part Number: BSH103; Pin Count: 3; Case: SOT23-3; Mounted: Yes; Socket: No; SMD: Yes; Sense: No; ComponentHeight: 1.1mm; HelpURL: \\cern.ch\dfs\Applications\Altium\Datasheets\BSH103.pdf; Author: CERN DEM JLC; CreateDate: 16.03.2010; LatestRevisionDate: 20.06.2017
TP1-TP11 = SMD_PAD_1.27X1.27MM: Part Description: 1.27mm x 1.27mm PCB Copper Area (SMD Test Point); Mounted: No; Part Number: SMD_PAD_1.27X1.27MM; Component Type: Standard (No BOM); Pin Count: 1; Family: Test Point; Socket: No; SMD: Yes; Sense: No; Status: None; ComponentHeight: 0mm; HelpURL: Undefined; Author: CERN DEM JLC; CreateDate: 12.01.2008; LatestRevisionDate: 12.01.2008; PackageDescription: 1.27mm x 1.27mm PCB Copper Area (SMD Test Point)
W1-W3 = SAMTEC_HTSW-104-23-L-S: 4 Mini Wire-Wrap Contact Strip Header; Part Description: 4 Contacts, Pitch 2.54mm, Single Row  Through Mount Straight Header (Post Lead 5.84mm, Tail Lead 2.92mm, Insulator 2.54mm); Manufacturer: SAMTEC; PressFit: No; Status Comment: High Temperature; Part Number: SAMTEC_HTSW-104-23-L-S; Component Kind: Standard; Component Type: Standard; Pin Count: 4; Family: Header 4; Mounted: Yes; Socket: No; Sense: No; SMD: No; Status: Preferred; Manufacturer Part Number: HTSW-104-23-L-S; ComponentHeight: 8.38mm; HelpURL: \\cern.ch\dfs\Applications\Altium\Datasheets\SAMTEC_HTSW-104-23-L-S.pdf; Author: CERN DEM JLC; CreateDate: 22/02/2018; LatestRevisionDate: 22/02/2018